# Altium schematic sheet CPU.SchDoc
size A4
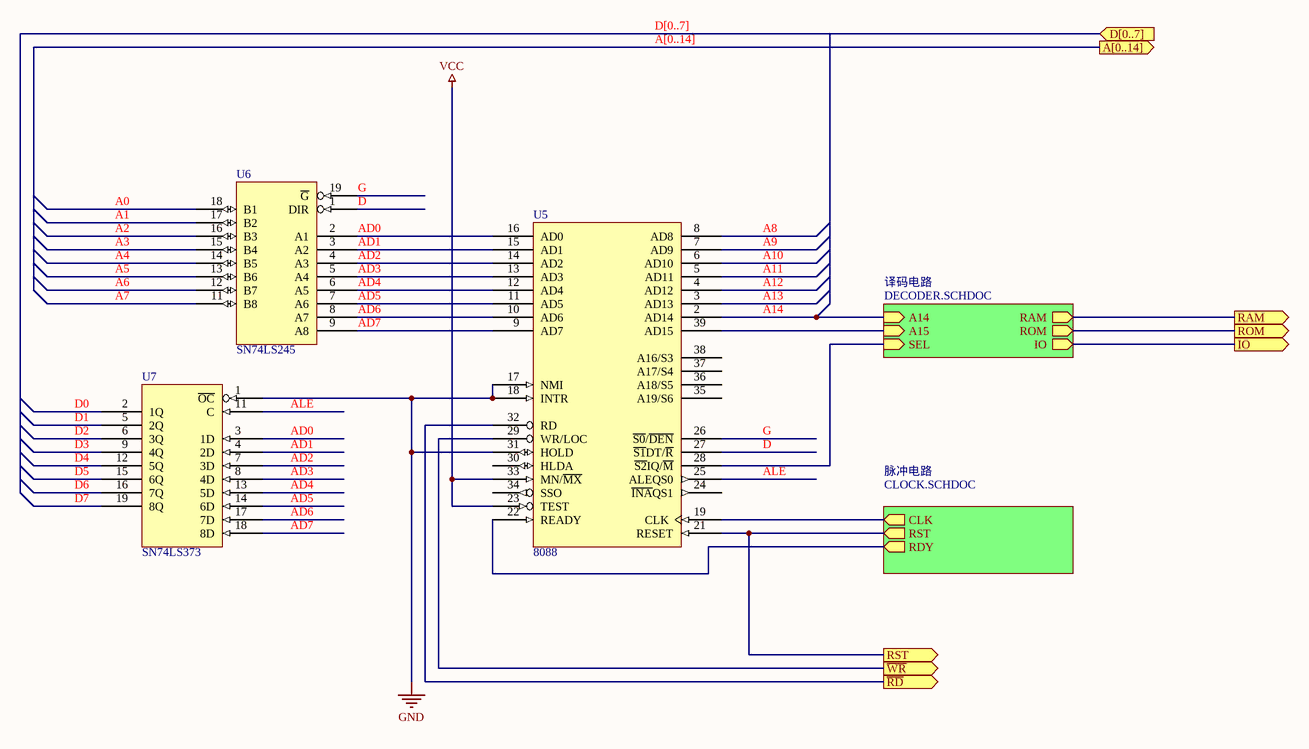
[diagram p0: CPU.SchDoc]

## Parts
U5  8088  [DIP40]
U6  SN74LS245  [SOICW20]
U7  SN74LS373  [DIP20]

## Sub-sheets
脉冲电路 = CLOCK.SCHDOC: CLK (out), RST (out), RDY (out)
译码电路 = DECODER.SCHDOC: A14 (in), A15 (in), SEL (in), RAM (out), ROM (out), IO (out)

## Ports
A[0..14] (out), D[0..7] (in), IO (out), RAM (out), ROM (out), RST (out), ~{RD} (out), ~{WR} (out)

## Nets
GND: U5.1(GND) U5.17(NMI) U5.18(INTR) U5.20(GND) U5.31(HOLD) U6.10(GND) U7.1(~{OC}) U7.10(GND)
VCC: U5.23(TEST) U5.33(MN/~{MX}) U5.40(VCC) U6.20(VCC) U7.20(VCC)
IO: port IO, sheet 译码电路/IO
~{RD}: U5.32(RD) ; port ~{RD}
RAM: port RAM, sheet 译码电路/RAM
ROM: port ROM, sheet 译码电路/ROM
RST: U5.21(RESET) ; port RST, sheet 脉冲电路/RST
~{WR}: U5.29(WR/LOC) ; port ~{WR}
NetU5_2: U5.2(AD14) ; sheet 译码电路/A14
NetU5_9: U5.9(AD7) U6.9(A8)
NetU5_10: U5.10(AD6) U6.8(A7)
NetU5_11: U5.11(AD5) U6.7(A6)
NetU5_12: U5.12(AD4) U6.6(A5)
NetU5_13: U5.13(AD3) U6.5(A4)
NetU5_14: U5.14(AD2) U6.4(A3)
NetU5_15: U5.15(AD1) U6.3(A2)
NetU5_16: U5.16(AD0) U6.2(A1)
NetU5_19: U5.19(CLK) ; sheet 脉冲电路/CLK
NetU5_22: U5.22(READY) ; sheet 脉冲电路/RDY
NetU5_28: U5.28(~{S2}IQ/~{M}) ; sheet 译码电路/SEL
NetU5_39: U5.39(AD15) ; sheet 译码电路/A15

Not connected (* = marked no-connect by the designer): U5 3(AD13) 4(AD12) 5(AD11) 6(AD10) 7(AD9) 8(AD8) 24(~{INA}QS1) 25(ALEQS0) 26(~{S0}/~{DEN}) 27(~{S1}DT/~{R}) 30(HLDA) 34(SSO) 35(A19/S6) 36(A18/S5) 37(A17/S4) 38(A16/S3); U6 1(DIR) 11(B8) 12(B7) 13(B6) 14(B5) 15(B4) 16(B3) 17(B2) 18(B1) 19(~{G}); U7 2(1Q) 3(1D) 4(2D) 5(2Q) 6(3Q) 7(3D) 8(4D) 9(4Q) 11(C) 12(5Q) 13(5D) 14(6D) 15(6Q) 16(7Q) 17(7D) 18(8D) 19(8Q)

## Notes on the sheet
- D[0..7]
- A[0..14]
- (near U6) G
- A0
- A1
- A2
- A3
- A4
- (near U6) AD0
- (near U6) AD1
- (near U6) AD2
- (near U6) D
- A10
- A9
- A8
- A5
- A6
- A7
- (near U6) AD3
- (near U6) AD4
- (near U6) AD5
- (near U6) AD6
- (near U6) AD7
- A14
- A13
- A12
- A11
- D0
- D1
- D2
- D3
- D4
- ALE
- AD0
- AD1
- AD2
- D
- G
- D5
- D6
- D7
- AD3
- AD4
- AD5
- AD6
- AD7